# EAGLE board drums (EAGLE 7.2.0)
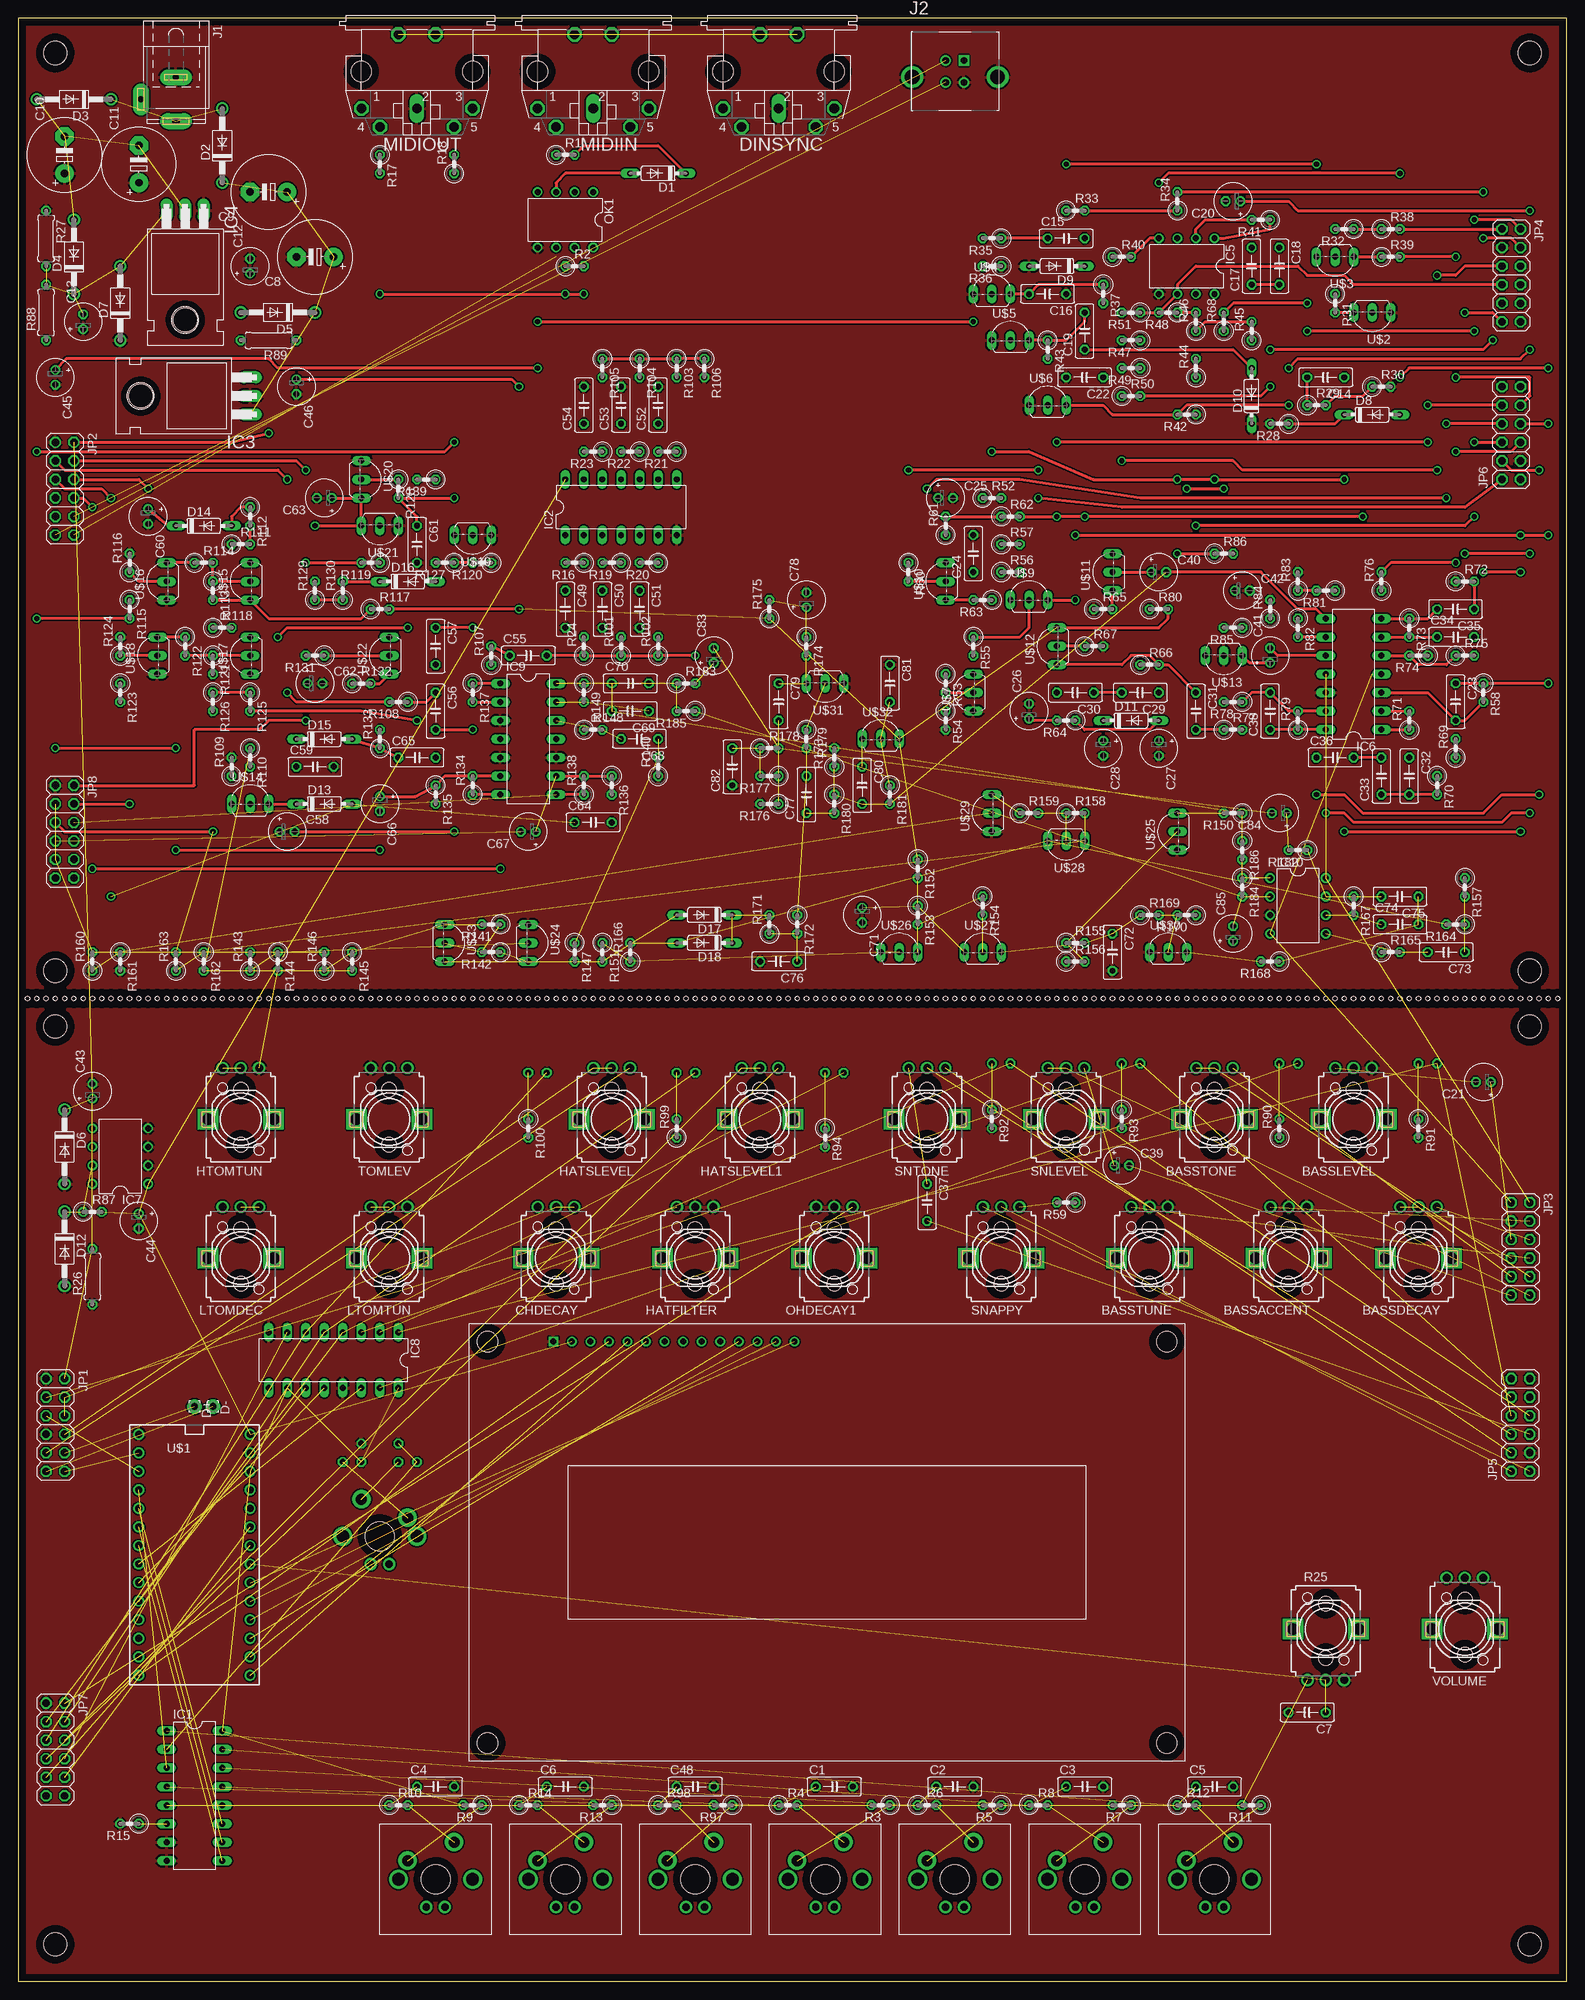
[diagram p2: board, top side]
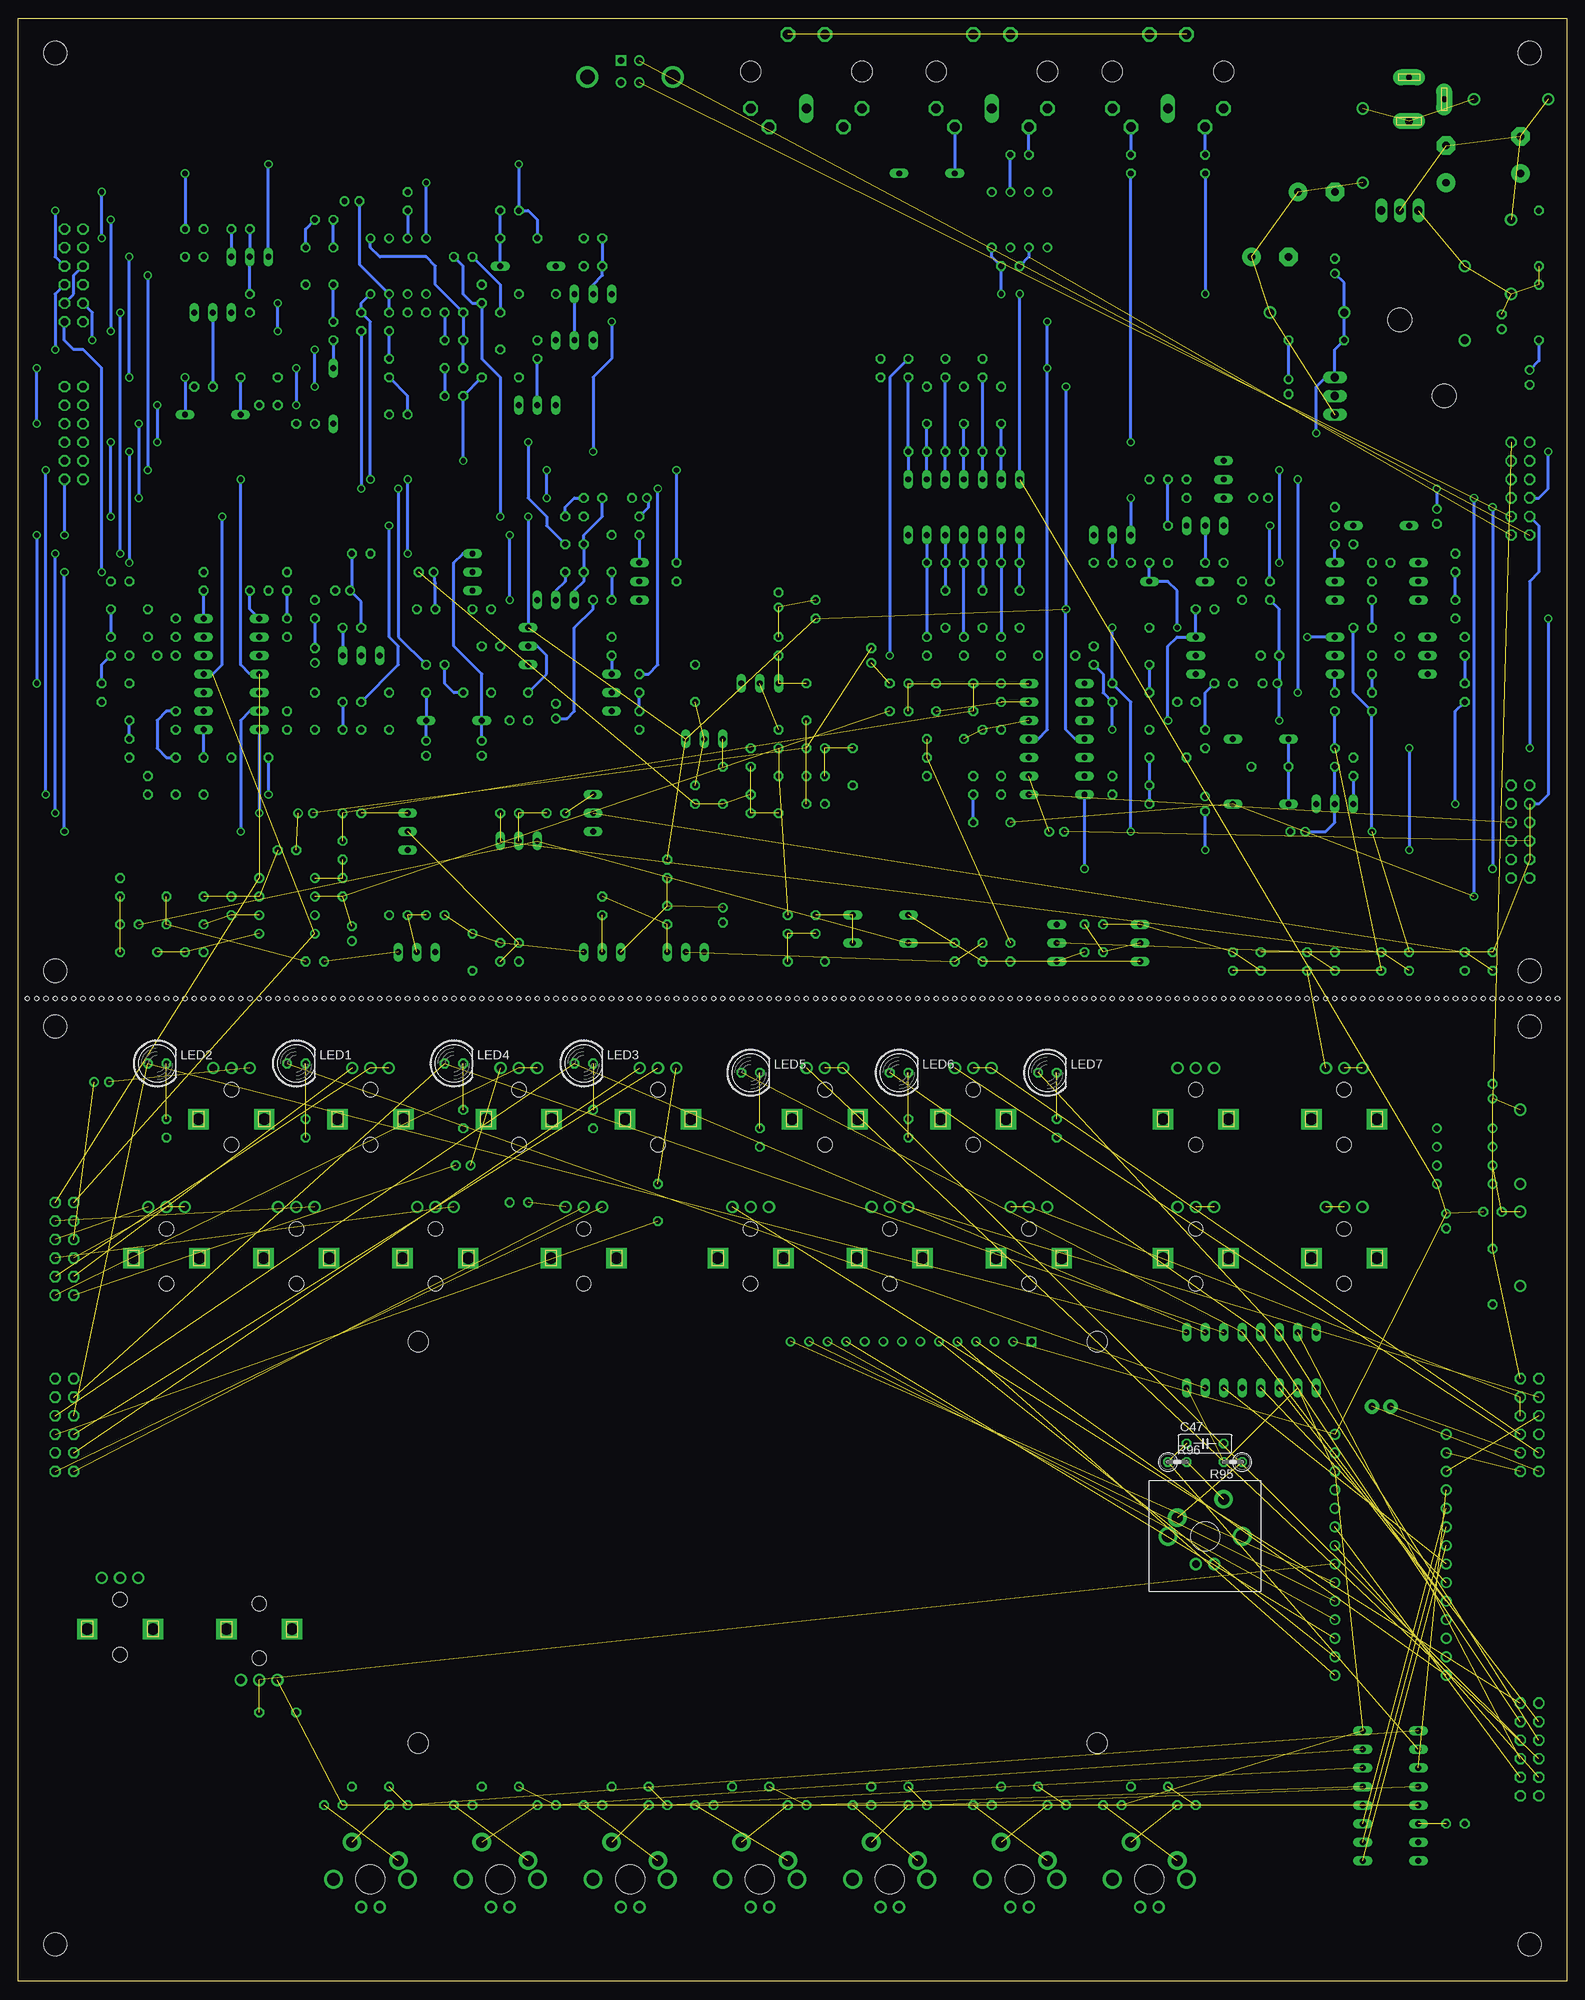
[diagram p3: board, bottom side, seen from below]

Size 212.07 x 268.91 mm. Coordinates in mm from the lower left corner, seen from the top.
Outline: 0,0 212.07,0 212.07,268.91 0,268.91 0,0
Copper layers (1*16): Top 0.035mm / dielectric 1.5mm / Bottom 0.035mm
Design rules "default": minimum track width 10mil, minimum drill 24mil, track to track 8mil, track to pad 8mil, pad to pad 8mil, via to via 8mil, smd to smd 8mil, copper to edge 40mil, drill to drill 8mil, minimum pad ring 10mil, minimum via ring 8mil, stop-mask expansion 4mil, vias tented up to drill 0mil, thermal gap 10mil
Holes 3.2 mm at 5.08,5.08 207.01,5.08 207.01,130.81 5.08,130.81 5.08,138.43 207.01,138.43 207.01,264.16 5.08,264.16
Holes 0.6 mm at 2.54,134.62 3.81,134.62 5.08,134.62 6.35,134.62 7.62,134.62 8.89,134.62 10.16,134.62 11.43,134.62 12.7,134.62 13.97,134.62 15.24,134.62 16.51,134.62 1.27,134.62 17.78,134.62 20.32,134.62 21.59,134.62 22.86,134.62 24.13,134.62 25.4,134.62 26.67,134.62 27.94,134.62 29.21,134.62 30.48,134.62 31.75,134.62 33.02,134.62 34.29,134.62 19.05,134.62 35.56,134.62 38.1,134.62 39.37,134.62 40.64,134.62 41.91,134.62 43.18,134.62 44.45,134.62 45.72,134.62 46.99,134.62 48.26,134.62 49.53,134.62 50.8,134.62 52.07,134.62 36.83,134.62 53.34,134.62 55.88,134.62 57.15,134.62 58.42,134.62 59.69,134.62 60.96,134.62 62.23,134.62 63.5,134.62 64.77,134.62 66.04,134.62 67.31,134.62 68.58,134.62 69.85,134.62 54.61,134.62 71.12,134.62 73.66,134.62 74.93,134.62 76.2,134.62 77.47,134.62 78.74,134.62 80.01,134.62 81.28,134.62 82.55,134.62 83.82,134.62 85.09,134.62 86.36,134.62 87.63,134.62 72.39,134.62 88.9,134.62 91.44,134.62 92.71,134.62 93.98,134.62 95.25,134.62 96.52,134.62 97.79,134.62 99.06,134.62 100.33,134.62 101.6,134.62 102.87,134.62 104.14,134.62 105.41,134.62 90.17,134.62 106.68,134.62 109.22,134.62 110.49,134.62 111.76,134.62 113.03,134.62 114.3,134.62 115.57,134.62 116.84,134.62 118.11,134.62 119.38,134.62 120.65,134.62 121.92,134.62 123.19,134.62 107.95,134.62 124.46,134.62 127,134.62 128.27,134.62 129.54,134.62 130.81,134.62 132.08,134.62 133.35,134.62 134.62,134.62 135.89,134.62 137.16,134.62 138.43,134.62 139.7,134.62 140.97,134.62 125.73,134.62 142.24,134.62 144.78,134.62 146.05,134.62 147.32,134.62 148.59,134.62 149.86,134.62 151.13,134.62 152.4,134.62 153.67,134.62 154.94,134.62 156.21,134.62 157.48,134.62 158.75,134.62 143.51,134.62 160.02,134.62 162.56,134.62 163.83,134.62 165.1,134.62 166.37,134.62 167.64,134.62 168.91,134.62 170.18,134.62 171.45,134.62 172.72,134.62 173.99,134.62 175.26,134.62 176.53,134.62 161.29,134.62 177.8,134.62 180.34,134.62 181.61,134.62 182.88,134.62 184.15,134.62 185.42,134.62 186.69,134.62 187.96,134.62 189.23,134.62 190.5,134.62 191.77,134.62 193.04,134.62 194.31,134.62 179.07,134.62 195.58,134.62 198.12,134.62 199.39,134.62 200.66,134.62 201.93,134.62 203.2,134.62 204.47,134.62 205.74,134.62 207.01,134.62 208.28,134.62 209.55,134.62 210.82,134.62 196.85,134.62

## Footprints (pad centres in the part's own frame; a part is rotated, then mirrored left to right if it is on the bottom)
EVUFXJ = drill 1.1 pad 1.676: 1 -2.5,-7; 2 0,-7; 3 2.5,-7 | drill 1.6 pad 2.8 square: M1 4.5,0; M2 -4.5,0 | hole 2: 0,3.5; 0,-4
C050-025X075 = drill 0.813 octagon: 1 -2.54,0; 2 2.54,0
E5-10,5 = drill 1.016 pad 2.54: + -2.54,0 | drill 1.016 pad 2.54 octagon: - 2.54,0
E2-5 = drill 0.813 pad 1.27: + -1.016,0 | drill 0.813 pad 1.27 octagon: - 1.016,0
DO35-7 = drill 0.813 long: A 3.81,0; C -3.81,0
DO41-10 = drill 1.118: A 5.08,0; C -5.08,0
2,0/0,9-R = drill 0.914 pad 2: 1 0,0
MAB5SH = drill 1.321 octagon: 1 7.62,5.08; 3 -7.62,5.08; 4 5.08,7.62; 5 -5.08,7.62; PE -2.54,-5.08; PE@ 2.54,-5.08 | drill 1.321 long: 2 0,5.08 | hole 2.794: 7.62,0; -7.62,0
CHERRY-MX-LED = drill 1.016 pad 1.676: LED1 -1.27,-3.81; LED2 1.27,-3.81 | drill 1.714 pad 1.93: P$3 -5.08,0; P$4 5.08,0 | drill 1.5 pad 2.54: SW1 -3.81,2.54; SW2 2.54,5.08 | hole 4: 0,0
DIL16 = drill 0.813 long: 1 -8.89,-3.81; 2 -6.35,-3.81; 3 -3.81,-3.81; 4 -1.27,-3.81; 5 1.27,-3.81; 6 3.81,-3.81; 7 6.35,-3.81; 8 8.89,-3.81; 9 8.89,3.81; 10 6.35,3.81; 11 3.81,3.81; 12 1.27,3.81; 13 -1.27,3.81; 14 -3.81,3.81; 15 -6.35,3.81; 16 -8.89,3.81
DIL14 = drill 0.813 long: 1 -7.62,-3.81; 2 -5.08,-3.81; 3 -2.54,-3.81; 4 0,-3.81; 5 2.54,-3.81; 6 5.08,-3.81; 7 7.62,-3.81; 8 7.62,3.81; 9 5.08,3.81; 10 2.54,3.81; 11 0,3.81; 12 -2.54,3.81; 13 -5.08,3.81; 14 -7.62,3.81
TO220H = drill 1.118 long: 1 -2.54,-10.16; 2 0,-10.16; 3 2.54,-10.16 | hole 3.302: 0,4.826
DIL08 = drill 0.813 pad 1.27: 1 -3.81,-3.81; 2 -1.27,-3.81; 3 1.27,-3.81; 4 3.81,-3.81; 5 3.81,3.81; 6 1.27,3.81; 7 -1.27,3.81; 8 -3.81,3.81
SPC4077 = drill 0.8 pad 2.184 long: 1 -3,0; 2 0,-4.8 | drill 1 pad 2.184 long: 3 3,0
JST_UBBS-4R-D14-4D = drill 0.92: D+ -1.25,-1.5; D- -1.25,1.5; GND 1.25,-1.5 | drill 2: SH1 -5.834,-0.758; SH5 5.85,-0.758 | drill 0.92 square: VCC 1.25,1.5
2X06 = drill 1.016 octagon: 1 -6.35,-1.27; 2 -6.35,1.27; 3 -3.81,-1.27; 4 -3.81,1.27; 5 -1.27,-1.27; 6 -1.27,1.27; 7 1.27,-1.27; 8 1.27,1.27; 9 3.81,-1.27; 10 3.81,1.27; 11 6.35,-1.27; 12 6.35,1.27
LED5MM = drill 0.813 octagon: A -1.27,0; K 1.27,0
0207/2V = drill 0.813 octagon: 1 -1.27,0; 2 1.27,0
0207/7 = drill 0.813 octagon: 1 -3.81,0; 2 3.81,0
TEENSY_3.0-3.2&LC_DIL = drill 0.965: 0 -7.62,13.97; 1 -7.62,11.43; 2 -7.62,8.89; 3 -7.62,6.35; 3.3V 7.62,11.43; 4 -7.62,3.81; 5 -7.62,1.27; 6 -7.62,-1.27; 7 -7.62,-3.81; 8 -7.62,-6.35; 9 -7.62,-8.89; 10 -7.62,-11.43; 11 -7.62,-13.97; 12 -7.62,-16.51; 13 7.62,-16.51; 14/A0 7.62,-13.97; 15/A1 7.62,-11.43; 16/A2 7.62,-8.89; 17/A3 7.62,-6.35; 18/A4 7.62,-3.81; 19/A5 7.62,-1.27; 20/A6 7.62,1.27; 21/A7 7.62,3.81; 22/A8 7.62,6.35; 23/A9 7.62,8.89; AGND 7.62,13.97; GND -7.62,16.51; VIN 7.62,16.51
TO92-EBC = drill 0.813 long: B 0,-1.27; C -2.54,-1.27; E 2.54,-1.27
CU20045-UW = drill 0.8 square: P$1 -8,0 | drill 0.8: P$2 -5.46,0; P$3 -2.92,0; P$4 -0.38,0; P$5 2.16,0; P$6 4.7,0; P$7 7.24,0; P$8 9.78,0; P$9 12.32,0; P$10 14.86,0; P$11 17.4,0; P$12 19.94,0; P$13 22.48,0; P$14 25.02,0 | hole 2.8: -17,0; -17,-55; 76,-55; 76,0

## Placement (x,y rotation side)
BASSACCENT  US-EVUF2J  [EVUFXJ]  173.99,99.06 180 top
BASSDECAY  US-EVUF2J  [EVUFXJ]  191.77,99.06 180 top
BASSLEVEL  US-EVUF2J  [EVUFXJ]  182.88,118.11 180 top
BASSTONE  10k  [EVUFXJ]  163.83,118.11 180 top
BASSTUNE  250k  [EVUFXJ]  154.94,99.06 180 top
C1  100n  [C050-025X075]  111.76,26.67 0 top
C2  100n  [C050-025X075]  128.27,26.67 0 top
C3  100n  [C050-025X075]  146.05,26.67 0 top
C4  100n  [C050-025X075]  57.15,26.67 0 top
C5  100n  [C050-025X075]  163.83,26.67 0 top
C6  100n  [C050-025X075]  74.93,26.67 0 top
C7  100n  [C050-025X075]  176.53,36.83 180 top
C8  3300u  [E5-10,5]  40.64,236.22 180 top
C9  3300u  [E5-10,5]  34.29,245.11 180 top
C10  3300u  [E5-10,5]  6.35,250.19 90 top
C11  3300u  [E5-10,5]  16.51,248.92 90 top
C12  1u  [E2-5]  31.75,234.95 90 top
C13  1u  [E2-5]  8.89,227.33 90 top
C14  100n  [C050-025X075]  179.07,219.71 180 top
C15  15n  [C050-025X075]  143.51,238.76 0 top
C16  100n  [C050-025X075]  140.97,231.14 180 top
C17  15n  [C050-025X075]  168.91,234.95 90 top
C18  15n  [C050-025X075]  172.72,234.95 270 top
C19  33n  [C050-025X075]  146.05,226.06 90 top
C20  33u  [E2-5]  166.37,243.84 180 top
C21  1u  [E2-5]  200.66,123.19 180 top
C22  100n  [C050-025X075]  146.05,219.71 180 top
C23  5.8n  [C050-025X075]  196.85,175.26 270 top
C24  47n  [C050-025X075]  130.81,195.58 90 top
C25  47u  [E2-5]  127,203.2 0 top
C26  100n  [E2-5]  138.43,173.99 90 top
C27  1n  [E2-5]  156.21,168.91 270 top
C28  2.7n  [E2-5]  148.59,168.91 270 top
C29  1.5n  [C050-025X075]  153.67,176.53 180 top
C30  1.5n  [C050-025X075]  144.78,176.53 180 top
C31  10n  [C050-025X075]  161.29,173.99 270 top
C32  1.5n  [C050-025X075]  190.5,165.1 270 top
C33  1.5n  [C050-025X075]  186.69,165.1 90 top
C34  1.5n  [C050-025X075]  196.85,184.15 0 top
C35  1.5n  [C050-025X075]  196.85,187.96 180 top
C36  47n  [C050-025X075]  180.34,167.64 0 top
C37  47n  [C050-025X075]  124.46,106.68 270 top
C38  220p  [C050-025X075]  171.45,173.99 90 top
C39  33u  [E2-5]  151.13,111.76 0 top
C40  22n  [E2-5]  156.21,193.04 0 top
C41  1u  [E2-5]  171.45,181.61 90 top
C42  47u  [E2-5]  167.64,190.5 0 top
C43  33u  [E2-5]  10.16,121.92 90 top
C44  220u  [E2-5]  16.51,104.14 270 top
C45  33u  [E2-5]  5.08,219.71 270 top
C46  33u  [E2-5]  38.1,218.44 270 top
C47  100n  [C050-025X075]  49.53,73.66 0 bottom
C48  100n  [C050-025X075]  92.71,26.67 0 top
C49  15n  [C050-025X075]  74.93,187.96 270 top
C50  10n  [C050-025X075]  80.01,187.96 270 top
C51  10n  [C050-025X075]  85.09,187.96 270 top
C52  15n  [C050-025X075]  87.63,215.9 90 top
C53  12n  [C050-025X075]  82.55,215.9 90 top
C54  12n  [C050-025X075]  77.47,215.9 90 top
C55  3.3n  [C050-025X075]  69.85,181.61 0 top
C56  15n  [C050-025X075]  57.15,173.99 270 top
C57  15n  [C050-025X075]  57.15,182.88 270 top
C58  1u  [E2-5]  36.83,157.48 0 top
C59  np  [C050-025X075]  40.64,166.37 0 top
C60  .47u  [E2-5]  17.78,200.66 270 top
C61  5.6n  [C050-025X075]  54.61,196.85 270 top
C62  1u  [E2-5]  40.64,177.8 0 top
C63  np  [E2-5]  41.91,203.2 180 top
C64  15n  [C050-025X075]  78.74,158.75 0 top
C65  15n  [C050-025X075]  54.61,167.64 0 top
C66  33u  [E2-5]  49.53,161.29 270 top
C67  33u  [E2-5]  69.85,157.48 180 top
C68  4.7n  [C050-025X075]  85.09,170.18 180 top
C69  27n  [C050-025X075]  83.82,173.99 180 top
C70  27n  [C050-025X075]  83.82,177.8 0 top
C71  47u  [E2-5]  115.57,146.05 270 top
C72  .47u  [C050-025X075]  149.86,140.97 270 top
C73  3.9n  [C050-025X075]  195.58,140.97 180 top
C74  18n  [C050-025X075]  189.23,144.78 0 top
C75  18n  [C050-025X075]  189.23,148.59 180 top
C76  68n  [C050-025X075]  104.14,139.7 180 top
C77  47n  [C050-025X075]  107.95,162.56 90 top
C78  47u  [E2-5]  107.95,189.23 90 top
C79  47n  [C050-025X075]  104.14,175.26 270 top
C80  39n  [C050-025X075]  115.57,163.83 270 top
C81  18n  [C050-025X075]  119.38,177.8 270 top
C82  10n  [C050-025X075]  97.79,166.37 90 top
C83  1u  [E2-5]  95.25,181.61 90 top
C84  1u  [E2-5]  172.72,160.02 180 top
C85  33u  [E2-5]  166.37,143.51 90 top
CHDECAY  50k  [EVUFXJ]  73.66,99.06 180 top
D1  1N4148DO35-7  [DO35-7]  87.63,247.65 180 top
D2  1N4004  [DO41-10]  27.94,251.46 90 top
D3  1N4004  [DO41-10]  7.62,257.81 180 top
D4  1N4004  [DO41-10]  7.62,236.22 90 top
D5  1N4004  [DO41-10]  35.56,228.6 180 top
D6  1N4004  [DO41-10]  6.35,114.3 270 top
D7  1N4004  [DO41-10]  13.97,229.87 90 top
D8  1N4148DO35-7  [DO35-7]  185.42,214.63 0 top
D9  1N4148DO35-7  [DO35-7]  142.24,234.95 180 top
D10  1N4148DO35-7  [DO35-7]  168.91,217.17 90 top
D11  1N4148DO35-7  [DO35-7]  152.4,172.72 0 top
D12  1N4004  [DO41-10]  6.35,100.33 270 top
D13  1N4148DO35-7  [DO35-7]  41.91,161.29 0 top
D14  1N4148DO35-7  [DO35-7]  25.4,199.39 0 top
D15  1N4148DO35-7  [DO35-7]  41.91,170.18 0 top
D16  1N4148DO35-7  [DO35-7]  53.34,191.77 0 top
D17  1N4148DO35-7  [DO35-7]  93.98,146.05 180 top
D18  1N4148DO35-7  [DO35-7]  93.98,142.24 180 top
D+  [2,0/0,9-R]  24.13,78.74 270 top
D-  [2,0/0,9-R]  26.67,78.74 270 top
DINSYNC  MAB5SH  [MAB5SH]  104.14,261.62 180 top
EDIT  CHERRY-MX-LED  [CHERRY-MX-LED]  128.27,13.97 0 top
HATFILTER  10k  [EVUFXJ]  92.71,99.06 180 top
HATSLEVEL  500k  [EVUFXJ]  81.28,118.11 180 top
HATSLEVEL1  500k  [EVUFXJ]  101.6,118.11 180 top
HTOMTUN  1k  [EVUFXJ]  30.48,118.11 180 top
IC1  4051N  [DIL16]  24.13,25.4 270 top
IC2  4584N  [DIL14]  82.55,201.93 0 top
IC3  7812T  [TO220H]  21.59,217.17 90 top
IC4  [TO220H]  22.86,232.41 180 top
IC5  OPA2134P  [DIL08]  160.02,234.95 180 top
IC6  OPA4130P  [DIL14]  182.88,179.07 90 top
IC7  LM2574HVN-5.0  [DIL08]  13.97,113.03 90 top
IC8  74LS595N  [DIL16]  43.18,85.09 180 top
IC9  OPA4130P  [DIL14]  69.85,170.18 270 top
IC10  OPA2134P  [DIL08]  175.26,147.32 270 top
J1  [SPC4077]  21.59,257.81 270 top
J2  UBBS-4R-D14-4D  [JST_UBBS-4R-D14-4D]  128.27,261.62 0 top
JP1  [2X06]  5.08,76.2 270 top
JP2  [2X06]  6.35,204.47 270 top
JP3  [2X06]  205.74,100.33 270 top
JP4  [2X06]  204.47,233.68 270 top
JP5  [2X06]  205.74,76.2 90 top
JP6  [2X06]  204.47,212.09 90 top
JP7  [2X06]  5.08,31.75 270 top
JP8  [2X06]  6.35,157.48 270 top
LED1  [LED5MM]  173.99,125.73 0 bottom
LED2  [LED5MM]  193.04,125.73 0 bottom
LED3  [LED5MM]  134.62,125.73 0 bottom
LED4  [LED5MM]  152.4,125.73 0 bottom
LED5  [LED5MM]  111.76,124.46 0 bottom
LED6  [LED5MM]  91.44,124.46 0 bottom
LED7  [LED5MM]  71.12,124.46 0 bottom
LEFT  CHERRY-MX-LED  [CHERRY-MX-LED]  146.05,13.97 0 top
LTOMDEC  1M  [EVUFXJ]  30.48,99.06 180 top
LTOMTUN  1k  [EVUFXJ]  50.8,99.06 180 top
MENU  CHERRY-MX-LED  [CHERRY-MX-LED]  57.15,13.97 0 top
MENU1  CHERRY-MX-LED  [CHERRY-MX-LED]  49.53,60.96 0 bottom
MENU2  CHERRY-MX-LED  [CHERRY-MX-LED]  92.71,13.97 0 top
MIDIIN  MAB5SH  [MAB5SH]  78.74,261.62 180 top
MIDIOUT  MAB5SH  [MAB5SH]  54.61,261.62 180 top
OHDECAY1  500k  [EVUFXJ]  111.76,99.06 180 top
OK1  6N138  [DIL08]  74.93,241.3 180 top
PLAY  CHERRY-MX-LED  [CHERRY-MX-LED]  163.83,13.97 0 top
R1  220  [0207/2V]  74.93,250.19 0 top
R2  470  [0207/2V]  76.2,234.95 0 top
R3  10k  [0207/2V]  118.11,24.13 180 top
R4  10k  [0207/2V]  105.41,24.13 0 top
R5  10k  [0207/2V]  133.35,24.13 180 top
R6  10k  [0207/2V]  124.46,24.13 0 top
R7  10k  [0207/2V]  151.13,24.13 180 top
R8  10k  [0207/2V]  139.7,24.13 0 top
R9  10k  [0207/2V]  62.23,24.13 180 top
R10  10k  [0207/2V]  52.07,24.13 0 top
R11  10k  [0207/2V]  168.91,24.13 180 top
R12  10k  [0207/2V]  160.02,24.13 0 top
R13  10k  [0207/2V]  80.01,24.13 180 top
R14  10k  [0207/2V]  69.85,24.13 0 top
R15  1K  [0207/2V]  15.24,21.59 180 top
R16  330k  [0207/2V]  76.2,194.31 180 top
R17  47  [0207/2V]  49.53,248.92 270 top
R18  47  [0207/2V]  59.69,248.92 90 top
R19  470k  [0207/2V]  81.28,194.31 180 top
R20  330k  [0207/2V]  86.36,194.31 180 top
R21  470k  [0207/2V]  88.9,209.55 180 top
R22  560k  [0207/2V]  83.82,209.55 180 top
R23  560k  [0207/2V]  78.74,209.55 180 top
R24  150k  [0207/2V]  77.47,182.88 90 top
R25  US-EVUF2J  [EVUFXJ]  179.07,48.26 0 top
R26  10K  [0207/7]  10.16,96.52 90 top
R27  10K  [0207/7]  3.81,238.76 270 top
R28  100k  [0207/2V]  172.72,213.36 180 top
R29  22k  [0207/2V]  177.8,215.9 0 top
R30  10k  [0207/2V]  186.69,218.44 0 top
R31  10k  [0207/2V]  180.34,229.87 270 top
R32  4.7k  [0207/2V]  181.61,240.03 180 top
R33  100k  [0207/2V]  144.78,242.57 0 top
R34  100k  [0207/2V]  158.75,243.84 90 top
R35  8.2k  [0207/2V]  133.35,238.76 180 top
R36  2.7k  [0207/2V]  133.35,234.95 180 top
R37  1M  [0207/2V]  148.59,231.14 270 top
R38  10k  [0207/2V]  187.96,240.03 0 top
R39  10k  [0207/2V]  187.96,236.22 0 top
R40  22k  [0207/2V]  151.13,236.22 0 top
R41  1M  [0207/2V]  170.18,241.3 180 top
R42  47k  [0207/2V]  160.02,214.63 180 top
R43  100k  [0207/2V]  140.97,223.52 270 top
R44  5.8k  [0207/2V]  161.29,220.98 90 top
R45  1M  [0207/2V]  168.91,226.06 90 top
R46  470k  [0207/2V]  161.29,227.33 90 top
R47  47k  [0207/2V]  152.4,224.79 180 top
R48  47k  [0207/2V]  157.48,228.6 180 top
R49  220  [0207/2V]  152.4,220.98 180 top
R50  10k  [0207/2V]  152.4,217.17 0 top
R51  470k  [0207/2V]  152.4,228.6 180 top
R52  10k  [0207/2V]  133.35,203.2 0 top
R53  22k  [0207/2V]  127,177.8 270 top
R54  10k  [0207/2V]  127,172.72 270 top
R55  10k  [0207/2V]  130.81,182.88 270 top
R56  4.7k  [0207/2V]  135.89,193.04 0 top
R57  10k  [0207/2V]  135.89,196.85 0 top
R58  100k  [0207/2V]  200.66,176.53 270 top
R59  1k  [0207/2V]  143.51,106.68 180 top
R60  33k  [0207/2V]  121.92,193.04 270 top
R61  1k  [0207/2V]  127,199.39 90 top
R62  1k  [0207/2V]  135.89,200.66 0 top
R63  15k  [0207/2V]  132.08,189.23 180 top
R64  15k  [0207/2V]  143.51,172.72 180 top
R65  100  [0207/2V]  148.59,187.96 0 top
R66  22k  [0207/2V]  154.94,180.34 0 top
R67  47k  [0207/2V]  147.32,182.88 0 top
R68  22k  [0207/2V]  165.1,227.33 90 top
R69  580  [0207/2V]  196.85,168.91 90 top
R70  580  [0207/2V]  194.31,163.83 270 top
R71  820k  [0207/2V]  190.5,172.72 90 top
R72  580  [0207/2V]  198.12,191.77 0 top
R73  820k  [0207/2V]  190.5,185.42 270 top
R74  220  [0207/2V]  191.77,181.61 180 top
R75  8.2k  [0207/2V]  198.12,181.61 0 top
R76  47k  [0207/2V]  186.69,191.77 90 top
R77  27k  [0207/2V]  166.37,171.45 0 top
R78  100k  [0207/2V]  166.37,175.26 180 top
R79  470k  [0207/2V]  175.26,172.72 90 top
R80  2.2M  [0207/2V]  156.21,187.96 0 top
R81  1M  [0207/2V]  179.07,190.5 180 top
R82  330k  [0207/2V]  175.26,185.42 270 top
R83  4.7k  [0207/2V]  175.26,191.77 90 top
R84  300k  [0207/2V]  171.45,187.96 90 top
R85  1M  [0207/2V]  166.37,185.42 180 top
R86  100  [0207/2V]  165.1,195.58 0 top
R87  330uh  [0207/2V]  10.16,105.41 0 top
R88  10  [0207/7]  3.81,228.6 90 top
R89  10  [0207/7]  34.29,224.79 180 top
R90  10k  [0207/2V]  172.72,116.84 90 top
R91  10k  [0207/2V]  191.77,116.84 270 top
R92  10k  [0207/2V]  133.35,118.11 270 top
R93  10k  [0207/2V]  151.13,118.11 270 top
R94  10k  [0207/2V]  110.49,115.57 270 top
R95  10k  [0207/2V]  45.72,71.12 180 bottom
R96  10k  [0207/2V]  53.34,71.12 0 bottom
R97  10k  [0207/2V]  96.52,24.13 180 top
R98  10k  [0207/2V]  88.9,24.13 0 top
R99  10k  [0207/2V]  90.17,116.84 90 top
R100  10k  [0207/2V]  69.85,116.84 270 top
R101  150k  [0207/2V]  82.55,182.88 90 top
R102  150k  [0207/2V]  87.63,182.88 90 top
R103  150k  [0207/2V]  90.17,220.98 270 top
R104  150k  [0207/2V]  85.09,220.98 270 top
R105  150k  [0207/2V]  80.01,220.98 270 top
R106  1k  [0207/2V]  93.98,220.98 270 top
R107  33k  [0207/2V]  64.77,181.61 90 top
R108  100  [0207/2V]  52.07,175.26 180 top
R109  100  [0207/2V]  29.21,166.37 90 top
R110  1M  [0207/2V]  31.75,167.64 270 top
R111  22k  [0207/2V]  30.48,196.85 0 top
R112  220  [0207/2V]  31.75,200.66 270 top
R113  4.7k  [0207/2V]  26.67,190.5 270 top
R114  10k  [0207/2V]  25.4,194.31 0 top
R115  22k  [0207/2V]  15.24,187.96 270 top
R116  10k  [0207/2V]  15.24,194.31 90 top
R117  10k  [0207/2V]  49.53,187.96 0 top
R118  4.7k  [0207/2V]  27.94,185.42 0 top
R119  330k  [0207/2V]  48.26,194.31 180 top
R120  10k  [0207/2V]  63.5,194.31 180 top
R121  4.7k  [0207/2V]  26.67,180.34 270 top
R122  10k  [0207/2V]  22.86,182.88 270 top
R123  22k  [0207/2V]  13.97,176.53 270 top
R124  10k  [0207/2V]  13.97,182.88 90 top
R125  10k  [0207/2V]  31.75,175.26 270 top
R126  4.7k  [0207/2V]  26.67,175.26 270 top
R127  22k  [0207/2V]  58.42,194.31 180 top
R128  100k  [0207/2V]  52.07,204.47 270 top
R129  100k  [0207/2V]  40.64,190.5 90 top
R130  220  [0207/2V]  44.45,190.5 90 top
R131  33k  [0207/2V]  40.64,181.61 180 top
R132  33k  [0207/2V]  46.99,177.8 0 top
R133  33k  [0207/2V]  49.53,170.18 90 top
R134  100k  [0207/2V]  62.23,163.83 90 top
R135  100k  [0207/2V]  57.15,162.56 270 top
R136  100k  [0207/2V]  81.28,163.83 270 top
R137  82k  [0207/2V]  62.23,176.53 270 top
R138  100k  [0207/2V]  77.47,163.83 90 top
R139  15k  [0207/2V]  55.88,205.74 180 top
R140  1k  [0207/2V]  87.63,166.37 90 top
R141  4.7k  [0207/2V]  64.77,144.78 180 top
R142  10k  [0207/2V]  64.77,140.97 180 top
R143  22k  [0207/2V]  31.75,139.7 90 top
R144  10k  [0207/2V]  35.56,139.7 270 top
R145  10k  [0207/2V]  45.72,139.7 270 top
R146  10k  [0207/2V]  41.91,139.7 90 top
R147  10k  [0207/2V]  76.2,140.97 270 top
R148  47k  [0207/2V]  78.74,171.45 0 top
R149  2.2M  [0207/2V]  77.47,176.53 270 top
R150  100  [0207/2V]  166.37,160.02 180 top
R151  100k  [0207/2V]  80.01,140.97 270 top
R152  100  [0207/2V]  123.19,152.4 270 top
R153  100k  [0207/2V]  123.19,146.05 270 top
R154  10k  [0207/2V]  132.08,147.32 270 top
R155  680k  [0207/2V]  144.78,142.24 0 top
R156  72k  [0207/2V]  144.78,139.7 0 top
R157  1k  [0207/2V]  198.12,149.86 270 top
R158  4.7k  [0207/2V]  144.78,160.02 0 top
R159  10k  [0207/2V]  138.43,160.02 0 top
R160  22k  [0207/2V]  10.16,139.7 90 top
R161  10k  [0207/2V]  13.97,139.7 270 top
R162  10k  [0207/2V]  25.4,139.7 270 top
R163  10k  [0207/2V]  21.59,139.7 90 top
R164  10k  [0207/2V]  196.85,144.78 180 top
R165  47k  [0207/2V]  187.96,140.97 0 top
R166  100k  [0207/2V]  83.82,140.97 90 top
R167  2.2M  [0207/2V]  182.88,147.32 270 top
R168  100  [0207/2V]  171.45,139.7 180 top
R169  680k  [0207/2V]  154.94,146.05 0 top
R170  39k  [0207/2V]  160.02,146.05 180 top
R171  2.2k  [0207/2V]  102.87,144.78 90 top
R172  1M  [0207/2V]  106.68,144.78 270 top
R173  33k  [0207/2V]  107.95,170.18 270 top
R174  4.7k  [0207/2V]  107.95,182.88 270 top
R175  10k  [0207/2V]  102.87,187.96 90 top
R176  4.7k  [0207/2V]  102.87,161.29 180 top
R177  4.7k  [0207/2V]  102.87,165.1 180 top
R178  100k  [0207/2V]  102.87,168.91 0 top
R179  4.7k  [0207/2V]  111.76,167.64 90 top
R180  10k  [0207/2V]  111.76,161.29 270 top
R181  22k  [0207/2V]  119.38,162.56 270 top
R182  15k  [0207/2V]  175.26,154.94 180 top
R183  15k  [0207/2V]  91.44,177.8 0 top
R184  47k  [0207/2V]  167.64,149.86 270 top
R185  33k  [0207/2V]  91.44,173.99 180 top
R186  47k  [0207/2V]  167.64,154.94 270 top
RIGHT  CHERRY-MX-LED  [CHERRY-MX-LED]  110.49,13.97 0 top
SELECT  CHERRY-MX-LED  [CHERRY-MX-LED]  74.93,13.97 0 top
SNAPPY  US-EVUF2J  [EVUFXJ]  134.62,99.06 180 top
SNLEVEL  US-EVUF2J  [EVUFXJ]  143.51,118.11 180 top
SNTONE  US-EVUF2J  [EVUFXJ]  124.46,118.11 180 top
TOMLEV  10k  [EVUFXJ]  50.8,118.11 180 top
U$1  TEENSY_3.1-3.2_DIL  [TEENSY_3.0-3.2&LC_DIL]  24.13,58.42 0 top
U$2  2N3904_  [TO92-EBC]  185.42,227.33 180 top
U$3  2N3906_  [TO92-EBC]  180.34,234.95 180 top
U$4  2N3904_  [TO92-EBC]  133.35,232.41 0 top
U$5  2N3904_  [TO92-EBC]  135.89,226.06 0 top
U$6  2N3904_  [TO92-EBC]  140.97,217.17 0 top
U$7  2N3904_  [TO92-EBC]  129.54,176.53 90 top
U$8  CU20045-UW  [CU20045-UW]  81.28,87.63 0 top
U$9  2N3906_  [TO92-EBC]  138.43,190.5 0 top
U$10  2N3904_  [TO92-EBC]  125.73,191.77 90 top
U$11  2N3904_  [TO92-EBC]  148.59,193.04 90 top
U$12  2N3904_  [TO92-EBC]  140.97,182.88 90 top
U$13  2N3904_  [TO92-EBC]  165.1,180.34 180 top
U$14  2N3904_  [TO92-EBC]  31.75,162.56 0 top
U$15  2N3906_  [TO92-EBC]  30.48,191.77 90 top
U$16  2N3904_  [TO92-EBC]  19.05,191.77 90 top
U$17  2N3906_  [TO92-EBC]  30.48,181.61 90 top
U$18  2N3904_  [TO92-EBC]  17.78,181.61 90 top
U$19  2N3904_  [TO92-EBC]  62.23,196.85 180 top
U$20  2N3904_  [TO92-EBC]  48.26,205.74 270 top
U$21  2N3904_  [TO92-EBC]  49.53,198.12 180 top
U$22  2N3904_  [TO92-EBC]  49.53,181.61 90 top
U$23  2N3906_  [TO92-EBC]  59.69,142.24 270 top
U$24  2N3904_  [TO92-EBC]  71.12,142.24 270 top
U$25  2N3904_  [TO92-EBC]  157.48,157.48 90 top
U$26  2N3904_  [TO92-EBC]  120.65,142.24 0 top
U$27  2N3906_  [TO92-EBC]  132.08,142.24 0 top
U$28  2N3906_  [TO92-EBC]  143.51,154.94 180 top
U$29  2N3904_  [TO92-EBC]  132.08,160.02 90 top
U$30  2N3904_  [TO92-EBC]  157.48,142.24 0 top
U$31  2N3904_  [TO92-EBC]  110.49,176.53 180 top
U$32  2N3904_  [TO92-EBC]  118.11,171.45 0 top
VOLUME  10k  [EVUFXJ]  198.12,48.26 180 top

## Tracks (layer width: path | path; a pad name or v marks a point on that pad's centre or on a via)
3.3V  (12 unrouted)
5V  (via drill 0.7)  (5 unrouted)
  Top 0.406: v49.53,231.14 v74.93,231.14 v77.47,231.14
  Bottom 0.406: R17.2 v49.53,231.14 | v77.47,231.14 R2.2 78.74,236.22 OK1.8 | IC2.14 v74.93,231.14
12V  (via drill 0.7)  (5 unrouted)
  Top 0.406: JP2.2 29.21,210.82 v34.29,212.09
  Bottom 0.406: v34.29,212.09 34.29,218.44 33.02,219.71 IC3.3 31.75,223.52 R89.2 D5.A 30.48,232.66 C12.+
+12V  (via drill 0.7)  (8 unrouted)
  Top 0.406: R38.2 JP4.1 | IC5.4 154.94,238.76 R40.2 | v189.23,247.65 157.48,247.65 v156.21,246.38 | U$12.E 156.21,185.42 157.48,186.69 R80.2 | R62.2 v142.24,200.66 v146.05,200.66 v184.15,200.66 | C46.+ 67.56,219.46 v68.58,218.44 | v68.58,187.96 R117.2 | v54.61,172.72 46.99,173.99 R125.2
  Bottom 0.406: IC5.4 v156.21,246.38 | v189.23,247.65 R38.2 | R40.2 151.13,234.95 151.13,231.14 149.86,229.87 R37.2 148.59,222.25 146.05,219.71 v146.05,200.66 | v142.24,200.66 U$12.E | IC6.4 185.42,179.07 184.15,180.34 v184.15,200.66 | R62.2 137.16,201.93 135.89,203.2 R52.2 | R110.1 R125.2 | C46.+ R89.1 | v68.58,218.44 v68.58,187.96 68.58,171.45 67.31,170.18 IC9.4 | v54.61,172.72 54.61,182.88 53.34,184.15 U$22.E R117.2
-12V  (via drill 0.7)  (2 unrouted)
  Top 0.406: JP4.2 204.47,241.3 v199.39,241.3 | v199.39,226.06 v176.53,226.06 | v176.53,229.87 166.37,229.87 R68.2 | v158.75,195.58 R86.1 | v181.61,205.74 v163.83,205.74 v158.75,205.74 147.32,205.74 138.43,209.55 v133.35,209.55 | v71.12,220.98 35.56,220.98 34.29,222.25 6.6,222.25 C45.+ | v71.12,227.33 v130.81,227.33
  Bottom 0.406: IC5.8 165.1,229.87 R68.2 163.83,227.33 v163.83,205.74 | v199.39,241.3 v199.39,226.06 | v176.53,226.06 v176.53,229.87 | v158.75,195.58 v158.75,205.74 | IC6.11 180.34,179.07 181.61,180.34 v181.61,205.74 | R88.1 3.81,222 C45.+ | v133.35,209.55 133.35,219.71 130.81,222.25 v130.81,227.33 | v71.12,227.33 v71.12,220.98 71.12,171.45 72.39,170.18 IC9.11
BASSACC1A  (1 unrouted)
BASSACC1B  (via drill 0.7)
  Top 0.406: JP4.4 204.47,238.76 v200.66,238.76 | v200.66,245.11 R34.2
  Bottom 0.406: v200.66,238.76 v200.66,245.11
BASSDEC1A  (1 unrouted)
BASSDEC1B  (via drill 0.7)
  Top 0.406: v207.01,242.57 175.26,242.57 173.99,243.84 C20.+
  Bottom 0.406: v207.01,242.57 207.01,236.22 JP4.6
BASSDEC2A  (2 unrouted)
BASSDEC2B
  Top 0.406: R51.1 R48.2 IC5.6 158.75,232.41 161.29,234.95 175.26,234.95 176.53,233.68 181.61,233.68 182.88,232.41 JP4.7
  Bottom 0.406: R51.1 R47.1
BASSLEV1A  (1 unrouted)
BASSLEV1B  (via drill 0.7)
  Top 0.406: JP4.5 198.12,234.95 196.85,233.68 v194.31,233.68 | v194.31,207.01 167.64,207.01 166.37,208.28 v151.13,208.28
  Bottom 0.406: C22.1 R50.1 v151.13,208.28 | v194.31,233.68 v194.31,207.01 | JP4.10 204.47,231.14 204.47,233.68 JP4.5
BASSTON1A  (1 unrouted)
BASSTON1B  (via drill 0.7)
  Top 0.406: v201.93,224.79 200.66,223.52 v171.45,223.52 | v171.45,218.44 170.18,217.17 R50.2
  Bottom 0.406: R49.1 R50.2 | v171.45,218.44 v171.45,223.52 | v201.93,224.79 201.93,228.6 JP4.9
BASSTON2A  (2 unrouted)
BASSTUN1A  (1 unrouted)
BASSTUN1B  (via drill 0.7)
  Top 0.406: v173.99,220.98 175.26,222.25 205.74,222.25 v207.01,223.52 | U$6.E 148.59,215.9 149.86,214.63 R42.2 160.02,215.9 v173.99,215.9
  Bottom 0.406: JP4.8 207.01,231.14 v207.01,223.52 | v173.99,220.98 v173.99,215.9 | R42.2 158.75,217.17 R44.1
CHATLEV2A  (1 unrouted)
CHATLEV2B  (1 unrouted)
CHATLEVA  (2 unrouted)
CHATLEVB  (1 unrouted)
  Top 0.406: R138.1 IC9.8
CHDEC2B  (via drill 0.7)  (2 unrouted)
  Top 0.406: JP2.5 6.35,204.47 11.43,204.47 v12.7,203.2
  Bottom 0.406: v12.7,203.2 v12.7,148.59
CHDEC3B  (via drill 0.7)
  Top 0.406: D14.C 20.57,199.39 C60.+ | JP2.6 16.51,205.74 v17.78,204.47
  Bottom 0.406: v17.78,204.47 C60.+
CHDECA  (3 unrouted)
CHDECB  (via drill 0.7)
  Top 0.406: v39.37,194.31 R119.2 | JP2.4 38.1,208.28 v39.37,207.01
  Bottom 0.406: v39.37,207.01 v39.37,194.31
D+A  (1 unrouted)
D+B  (1 unrouted)
D-A  (1 unrouted)
D-B  (1 unrouted)
GND  (1 unrouted)
  pour Top: -2.54,271.78 214.63,271.78 214.63,-2.54 -2.54,-1.27
HATLEV2A  (1 unrouted)
HATLEV2B  (via drill 0.7)
  Top 0.406: v5.08,168.91 v21.59,168.91 | v21.59,154.94 v49.53,154.94
  Bottom 0.406: JP2.9 3.81,199.39 3.81,193.04 5.08,191.77 v5.08,168.91 | v21.59,168.91 v21.59,154.94 | v49.53,154.94 C66.-
HATLEVA  (2 unrouted)
HATLEVB  (via drill 0.7)
  Top 0.406: IC9.7 R134.1 | JP2.8 8.89,203.2 v10.16,201.93 | v10.16,152.4 v66.04,152.4
  Bottom 0.406: v10.16,201.93 v10.16,152.4 | v66.04,152.4 IC9.7
HFILTA  (1 unrouted)
HFILTB  (via drill 0.7)
  Top 0.406: JP2.3 6.35,207.01 35.56,207.01 v36.83,205.74 | R108.2 38.1,175.26 v36.83,176.53
  Bottom 0.406: v36.83,205.74 v36.83,176.53
HTOMTUNA  (1 unrouted)
HTOMTUNB  (1 unrouted)
LTOMDECA  (1 unrouted)
LTOMDECB  (2 unrouted)
LTOMTUNA  (1 unrouted)
LTOMTUNB  (1 unrouted)
MIDRXA  (1 unrouted)
MIDRXB  (1 unrouted)
  Bottom 0.406: OK1.6 73.66,236.22 R2.1
MIDTXA  (1 unrouted)
MIDTXB  (via drill 0.7)
  Top 0.406: v2.54,209.55 58.42,209.55 v59.69,210.82
  Bottom 0.406: JP2.7 3.81,203.2 2.54,204.47 v2.54,209.55 | v59.69,210.82 R18.1
N$1  (1 unrouted)
N$2  (1 unrouted)
  Top 0.406: IC9.9 R138.2 R136.1
N$3  (2 unrouted)
N$4
  Top 0.406: R1.2 77.47,251.46 87.63,251.46 D1.C
  Bottom 0.406: OK1.2 R1.2
N$5
  Top 0.406: D1.A 74.93,247.65 73.66,246.38 OK1.3
  Bottom 0.406: MIDIIN.5 D1.A
N$6  (1 unrouted)
N$7  (1 unrouted)
N$8  (1 unrouted)
N$9  (1 unrouted)
N$10  (1 unrouted)
N$11  (1 unrouted)
N$12  (1 unrouted)
N$13  (2 unrouted)
N$14  (1 unrouted)
N$15  (1 unrouted)
N$16  (2 unrouted)
N$17  (1 unrouted)
N$18  (1 unrouted)
N$19  (2 unrouted)
N$20  (1 unrouted)
N$21  (1 unrouted)
N$22  (2 unrouted)
N$23  (1 unrouted)
N$24  (1 unrouted)
N$25  (2 unrouted)
N$26
  Bottom 0.406: R1.1 MIDIIN.4
N$27  (1 unrouted)
N$28  (1 unrouted)
N$29  (1 unrouted)
N$30  (1 unrouted)
N$31
  Bottom 0.406: IC2.9 R21.2 C52.1
N$33
  Bottom 0.406: R17.1 MIDIOUT.4
N$34
  Bottom 0.406: MIDIOUT.5 R18.2
N$35  (3 unrouted)
N$36  (2 unrouted)
N$37  (3 unrouted)
N$38  (1 unrouted)
N$40  (1 unrouted)
N$41  (1 unrouted)
N$42  (1 unrouted)
N$43  (1 unrouted)
N$44  (1 unrouted)
N$45  (1 unrouted)
N$46  (1 unrouted)
N$48  (2 unrouted)
N$49
  Bottom 0.406: IC2.8 R21.1 R103.2
N$50  (2 unrouted)
N$51  (2 unrouted)
N$52  (4 unrouted)
N$53  (4 unrouted)
N$54  (2 unrouted)
N$55
  Top 0.406: R28.1 180.34,213.36 D8.C
  Bottom 0.406: D8.C C14.1
N$56
  Top 0.406: R29.1 C14.2
N$57
  Top 0.406: R29.2 180.34,217.17 184.15,217.17 R30.1
  Bottom 0.406: U$2.B R30.1
N$58
  Top 0.406: U$2.E R31.2
N$59
  Bottom 0.406: R31.1 U$3.B R32.2
N$60
  Top 0.406: R32.1 R38.1 | U$3.C R39.1
  Bottom 0.406: R32.1 U$3.C
N$61  (via drill 0.7)
  Top 0.406: C15.1 R35.1 | v177.8,248.92 v143.51,248.92
  Bottom 0.406: C15.1 140.97,241.3 142.24,242.57 R33.1 v143.51,248.92 | U$3.E v177.8,248.92
N$62
  Top 0.406: IC5.2 161.29,240.03 162.56,241.3 R41.2
  Bottom 0.406: C17.2 R41.2
N$63
  Top 0.406: R33.2 R34.1
  Bottom 0.406: R34.1 IC5.3 | D9.C C15.2 R33.2
N$64
  Top 0.406: U$5.E R43.1 143.51,224.79 146.05,227.33 C19.2
  Bottom 0.406: R40.1 146.05,232.41 C19.2
N$65
  Top 0.406: IC5.1 165.1,238.76 171.45,240.03 R41.1
  Bottom 0.406: C18.1 172.72,240.03 R41.1 | R49.2 R47.2 R51.2 154.94,232.41 154.94,234.95 156.21,236.22 162.56,236.22 163.83,237.49 IC5.1
N$66
  Bottom 0.406: R35.2 R36.2 132.08,233.68 133.35,232.41 U$4.B
N$67
  Bottom 0.406: IC2.2 R16.1 R24.2
N$68
  Top 0.406: R37.1 139.7,232.41 C16.2 U$4.E
  Bottom 0.406: U$4.E U$5.B
N$69
  Top 0.406: IC6.3 193.04,176.53 C23.2 198.12,172.72 R58.2
  Bottom 0.406: R69.2 C23.2
N$70
  Bottom 0.406: U$6.B R43.2
N$71
  Bottom 0.406: C49.1 R16.2 IC2.1
N$72
  Top 0.406: C18.2 C17.1 | R46.1 162.56,227.33 R45.2
  Bottom 0.406: R45.2 C17.1 | R44.2 R46.1
N$73
  Top 0.406: C19.1 166.37,223.52 D10.A
  Bottom 0.406: R45.1 D10.A
N$74
  Bottom 0.406: IC2.3 R19.2 C50.1
N$75
  Bottom 0.406: IC2.4 R19.1 R101.2
N$76  (1 unrouted)
N$77
  Top 0.406: R46.2 R48.1
  Bottom 0.406: R46.2 IC5.7 165.35,235.2 C20.-
N$78  (1 unrouted)
N$79
  Bottom 0.406: IC2.6 R20.1 R102.2
N$80
  Bottom 0.406: IC2.5 R20.2 C51.1
N$81
  Top 0.406: R53.2 U$7.B
  Bottom 0.406: R54.1 R53.2
N$82
  Bottom 0.406: R55.2 U$7.E
N$83
  Top 0.406: R55.1 137.16,184.15 138.43,185.42 U$9.B
  Bottom 0.406: R56.2 137.16,191.77 138.43,190.5 U$9.B
N$84
  Bottom 0.406: U$9.C 135.89,190.5 134.62,191.77 R56.1 R57.1 134.62,198.12 132.08,200.66 R52.1
N$85
  Bottom 0.406: IC2.11 R22.2 C53.1
N$86
  Bottom 0.406: IC2.10 R22.1 R104.2
N$87
  Top 0.406: U$10.B R60.2
N$88
  Bottom 0.406: R61.1 U$10.E
N$89
  Top 0.406: R61.2 R62.1
  Bottom 0.406: R61.2 125.73,201.93 125.73,202.95 C25.+
N$90
  Top 0.406: R63.2 U$10.C
  Bottom 0.406: C24.1 R63.2
N$91
  Top 0.406: R64.2 138.68,172.72 C26.+
  Bottom 0.406: C26.+ 136.91,172.97 135.89,173.99 135.89,185.42 133.35,187.96 R63.1
N$92
  Top 0.406: D11.A 154.94,171.45 146.05,171.45 R64.1
  Bottom 0.406: C27.+ D11.A C29.1
N$93
  Top 0.406: R65.2 U$11.C
N$94
  Top 0.406: C29.2 C30.1
  Bottom 0.406: C29.2 152.4,176.53 153.67,177.8 R66.1
N$95
  Bottom 0.406: C28.+ D11.C 148.59,179.07 152.4,182.88 152.4,194.31 151.13,195.58 U$11.E
N$96
  Top 0.406: R67.1 U$12.B
  Bottom 0.406: C30.2 139.7,179.07 139.7,181.61 140.97,182.88 U$12.B
N$97  (via drill 0.7)
  Top 0.406: C31.1 157.48,180.34 R66.2 154.94,181.61 152.4,181.61 151.13,180.34 U$12.C | v160.02,204.47 v165.1,204.47
  Bottom 0.406: R66.2 160.02,184.15 v160.02,204.47 | R68.1 v165.1,204.47
N$98
  Top 0.406: R70.2 C32.2 C33.1
N$99
  Top 0.406: IC6.1 R71.1 | C33.2 C36.2
  Bottom 0.406: C33.2 IC6.1
N$100
  Top 0.406: IC6.2 R71.2
  Bottom 0.406: R71.2 191.77,173.99 193.04,172.72 193.04,168.91 191.77,167.64 C32.1
N$101
  Top 0.406: R72.2 C35.1
  Bottom 0.406: C35.1 C34.2
N$102
  Top 0.406: IC6.7 R73.1 193.04,186.69 C35.2
  Bottom 0.406: IC6.7 R76.1
N$103
  Top 0.406: IC6.6 R73.2 C34.1
N$104
  Top 0.406: IC6.5 R74.2 191.77,180.34 195.58,180.34 R75.1
N$105  (1 unrouted)
N$106
  Bottom 0.406: IC2.12 R23.1 R105.2
N$107
  Bottom 0.406: IC2.13 R23.2 C54.1
N$108
  Top 0.406: R77.1 C31.2
N$109
  Bottom 0.406: R110.2 U$14.B 31.75,158.75 33.02,157.48 C58.+
N$110  (via drill 0.7)
  Top 0.406: R105.1 R104.1 R103.1 R106.1 | v92.71,181.61 R102.1 R101.1 R24.1 C55.2
  Bottom 0.406: R103.1 92.71,219.71 v92.71,181.61
N$111  (1 unrouted)
N$112
  Top 0.406: U$11.B C40.+
  Bottom 0.406: R80.1 154.94,191.52 C40.+
N$113
  Top 0.406: IC6.9 R82.2
N$114  (1 unrouted)
N$115  (1 unrouted)
N$116
  Top 0.406: R81.2 R83.1
  Bottom 0.406: R82.1 R83.1
N$117
  Top 0.406: IC6.10 172.47,181.61 C41.-
  Bottom 0.406: R84.1 C41.-
N$118
  Top 0.406: C41.+ 168.66,180.59 U$13.C
  Bottom 0.406: R85.1 U$13.C
N$119
  Bottom 0.406: R86.2 166.37,190.75 C42.+ 165.1,188.98 R85.2
N$120  (2 unrouted)
N$121  (5 unrouted)
N$122  (1 unrouted)
N$123  (1 unrouted)
N$124  (1 unrouted)
N$125  (1 unrouted)
N$126  (1 unrouted)
N$127  (2 unrouted)
N$128  (1 unrouted)
N$129  (1 unrouted)
N$130  (2 unrouted)
N$131  (1 unrouted)
N$132  (2 unrouted)
N$133  (1 unrouted)
N$134  (2 unrouted)
N$137  (4 unrouted)
N$138  (3 unrouted)
N$143
  Top 0.406: C55.1 R107.2
N$144  (3 unrouted)
N$145  (2 unrouted)
N$146  (2 unrouted)
N$149  (via drill 0.7)
  Top 0.406: R137.2 IC9.2 | C56.2 v62.23,171.45
  Bottom 0.406: v62.23,171.45 R137.2 63.5,176.53 63.5,179.07 R107.1
N$150
  Top 0.406: R108.1 55.88,175.26 C56.1
  Bottom 0.406: C57.2 C56.1
N$151  (via drill 0.7)
  Top 0.406: IC9.1 R137.1 | C58.- v59.69,157.48 | v62.23,185.42 C57.1
  Bottom 0.406: v59.69,157.48 59.69,175.26 R137.1 v62.23,185.42
N$152
  Bottom 0.406: R109.1 U$14.C
N$155
  Top 0.406: U$14.E D13.C
  Bottom 0.406: D13.C C59.1 D15.C
N$157  (3 unrouted)
N$158
  Top 0.406: R112.1 30.48,201.93 29.21,200.66 D14.A
N$159
  Top 0.406: U$15.B R113.1 R114.2
N$161
  Top 0.406: R111.2 R112.2
  Bottom 0.406: U$15.E R111.2
N$162
  Top 0.406: R113.2 U$15.C 34.29,186.69 46.99,186.69 R117.1
  Bottom 0.406: R113.2 R118.1
N$163
  Top 0.406: R114.1 U$16.E
N$164
  Top 0.406: U$16.B 16.51,191.77 R116.1
  Bottom 0.406: R115.1 R116.1
N$165  (1 unrouted)
N$167  (2 unrouted)
N$168  (via drill 0.7)
  Top 0.406: v35.56,184.15 36.83,185.42 v53.34,185.42
  Bottom 0.406: R127.2 D16.A 54.61,191.77 53.34,190.5 v53.34,185.42 | U$17.E v35.56,184.15
N$169
  Top 0.406: U$17.B R121.1 R122.2
N$170
  Top 0.406: R125.1 R126.1
  Bottom 0.406: R121.2 R126.1 | R125.1 U$17.C
N$171
  Top 0.406: R122.1 U$18.E
N$173
  Top 0.406: U$18.B R124.1
  Bottom 0.406: R124.1 R123.1
N$174  (2 unrouted)
N$175  (3 unrouted)
N$176
  Top 0.406: R120.2 R127.1
  Bottom 0.406: U$19.B R120.2
N$177  (via drill 0.7)
  Top 0.406: C61.1 54.61,200.66 R128.2 v59.69,203.2
  Bottom 0.406: v59.69,203.2 U$19.E | C61.1 R139.2
N$178
  Top 0.406: D15.A R133.1 C65.1
N$179
  Top 0.406: U$20.B R128.1
N$180  (via drill 0.7)
  Top 0.406: C63.+ U$20.E U$21.E v40.64,199.39
  Bottom 0.406: R129.2 v40.64,199.39
N$181
  Top 0.406: R130.2 D16.C
N$182  (2 unrouted)
N$183
  Top 0.406: R131.1 U$22.B
N$184
  Top 0.406: R132.2 49.53,177.8 U$22.C
  Bottom 0.406: R133.2 49.53,176.53 R132.2
N$185
  Bottom 0.406: U$21.B R119.1
N$186  (3 unrouted)
N$187
  Bottom 0.406: C64.2 R136.2
N$188
  Bottom 0.406: C65.2 R135.2
N$189
  Top 0.406: IC9.6 R134.2 58.42,165.1 R135.1 54.36,162.31 C66.+
N$190  (1 unrouted)
N$191  (2 unrouted)
N$192  (2 unrouted)
N$193  (2 unrouted)
N$194  (2 unrouted)
N$195  (2 unrouted)
N$196  (1 unrouted)
N$197  (2 unrouted)
N$198  (3 unrouted)
N$199  (2 unrouted)
N$201  (2 unrouted)
N$202  (2 unrouted)
N$203  (2 unrouted)
N$204  (2 unrouted)
N$205  (2 unrouted)
N$206  (2 unrouted)
N$207  (1 unrouted)
N$208  (2 unrouted)
N$209  (3 unrouted)
N$210  (1 unrouted)
N$211  (1 unrouted)
OHDECA  (1 unrouted)
OHDECB  (via drill 0.7)
  Top 0.406: JP8.2 24.13,163.83 24.13,171.45 33.02,171.45 34.29,172.72 v39.37,172.72 | R130.1 R129.1
  Bottom 0.406: R129.1 39.37,187.96 R131.2 39.37,178.05 C62.+ 39.37,177.55 v39.37,172.72
PE  (5 unrouted)
SDOUT  (via drill 0.7)
  Top 0.406: IC6.14 R79.1 C38.1 | v207.01,195.58 v198.12,195.58 | v198.12,228.6 201.93,228.6 JP4.11 | v179.07,160.02 181.61,160.02 182.88,158.75 203.2,158.75 204.47,160.02 v207.01,160.02
  Bottom 0.406: IC6.14 v179.07,160.02 | v207.01,160.02 v207.01,195.58 | v198.12,195.58 v198.12,228.6
SNAP1A  (1 unrouted)
SNAP1B  (via drill 0.7)
  Top 0.406: C23.1 R58.1 v209.55,177.8 | U$9.E v144.78,189.23 | v144.78,198.12 v205.74,198.12 v209.55,198.12
  Bottom 0.406: R58.1 200.66,180.34 R75.2 | v144.78,189.23 v144.78,198.12 | v209.55,198.12 v209.55,177.8 | JP6.1 v205.74,198.12
SNAP2A  (1 unrouted)
SNAP2B  (via drill 0.7)
  Top 0.406: v139.7,207.01 v121.92,207.01 | JP6.2 198.12,201.93 151.13,201.93 v139.7,203.2
  Bottom 0.406: v139.7,203.2 v139.7,207.01 | v121.92,207.01 R60.1
SNLEV1A  (1 unrouted)
SNLEV2A  (2 unrouted)
SNLEV2B  (via drill 0.7)
  Top 0.406: IC6.13 R79.2 173.99,173.99 C38.2 168.91,176.53 R78.1 | v181.61,157.48 v205.74,157.48 | v205.74,193.04 v200.66,193.04
  Bottom 0.406: R78.1 R77.2 | IC6.13 180.34,173.99 181.61,172.72 v181.61,157.48 | v205.74,157.48 v205.74,193.04 | v200.66,193.04 200.66,220.98 203.2,223.52 204.47,223.52 205.74,224.79 JP4.12
SNTON1A  (1 unrouted)
SNTON1B  (via drill 0.7)
  Top 0.406: JP6.4 204.47,207.01 v208.28,207.01 | v208.28,162.56 203.2,162.56 200.66,160.02 184.15,160.02 181.61,162.56 v177.8,162.56
  Bottom 0.406: C36.1 v177.8,162.56 | v208.28,162.56 v208.28,207.01
SNTON2A  (1 unrouted)
SNTON2B  (via drill 0.7)
  Top 0.406: JP6.5 204.47,209.55 v196.85,209.55 | v196.85,194.31 187.96,194.31 R76.2
  Bottom 0.406: v196.85,209.55 v196.85,194.31
SNTON3A  (1 unrouted)
SNTON3B  (via drill 0.7)
  Top 0.406: v199.39,210.82 JP6.6 | v199.39,200.66 198.12,199.39 v161.29,199.39
  Bottom 0.406: R78.2 160.02,180.34 160.02,182.88 161.29,184.15 v161.29,199.39 | v199.39,200.66 v199.39,210.82
T1  (1 unrouted)
T1B  (via drill 0.7)
  Top 0.406: JP6.7 v209.55,213.36 | v209.55,220.98 190.5,220.98 v189.23,219.71
  Bottom 0.406: v209.55,213.36 v209.55,220.98 | v189.23,219.71 D8.A
T2  (2 unrouted)
T2B  (via drill 0.7)
  Top 0.406: JP6.8 v195.58,213.36 | v195.58,203.2 153.67,203.2 137.16,205.74 125.73,205.74 v124.46,204.47
  Bottom 0.406: v195.58,213.36 v195.58,203.2 | R53.1 125.73,179.07 124.46,180.34 v124.46,204.47
T3  (2 unrouted)
T3B  (via drill 0.7)
  Top 0.406: v196.85,219.71 207.01,219.71 207.01,217.17 JP6.9 | v196.85,236.22 R39.2
  Bottom 0.406: v196.85,219.71 v196.85,236.22
T4  (2 unrouted)
T4B  (via drill 0.7)
  Top 0.406: JP6.10 v193.04,215.9 | v193.04,210.82 v142.24,210.82
  Bottom 0.406: v193.04,215.9 v193.04,210.82 | v142.24,210.82 142.24,203.2 139.7,200.66 139.7,199.39 R57.2
T5  (2 unrouted)
T6  (2 unrouted)
T6B  (via drill 0.7)
  Top 0.406: JP8.4 v15.24,161.29
  Bottom 0.406: v15.24,161.29 15.24,173.99 R123.2
T7  (2 unrouted)
T7B  (via drill 0.7)  (2 unrouted)
  Top 0.406: JP8.5 6.35,157.48 v26.67,157.48
  Bottom 0.406: R118.2 29.21,176.53 R126.2 v26.67,157.48
T8  (1 unrouted)
T9  (1 unrouted)
T9B  (via drill 0.7)  (3 unrouted)
  Top 0.406: R115.2 v2.54,186.69
  Bottom 0.406: v2.54,186.69 2.54,162.56 3.81,161.29 JP8.3
T10  (1 unrouted)
TOMSLEVB  (2 unrouted)
WNOISE  (3 unrouted)
  Top 0.406: IC6.8 177.8,187.96 175.26,187.96 170.18,193.04 C40.-
  Bottom 0.406: IC6.8 180.34,187.96 R81.1